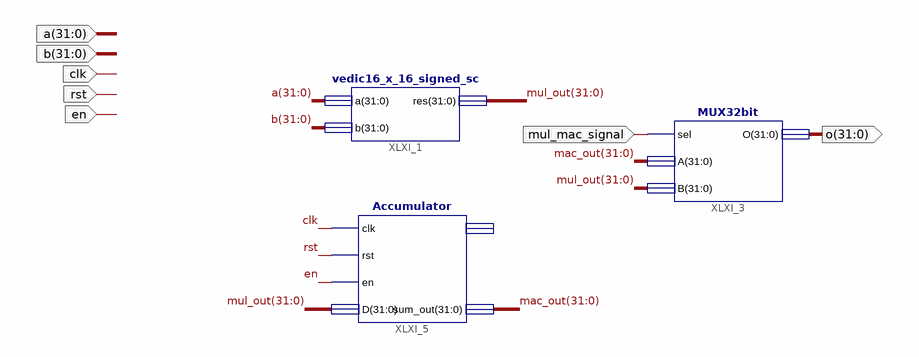
[diagram p0: schematic sheet 1]
// Xilinx ISE schematic MAC_Unit.sch (spartan6) as structural Verilog: 3 symbols, 7 ports
module MAC_Unit (
  input  [31:0] a,
  input  [31:0] b,
  input  clk,
  input  rst,
  input  en,
  input  mul_mac_signal,
  output [31:0] o
);

  wire [31:0] mac_out, mul_out;

  vedic16_x_16_signed_sc XLXI_1 (.a(a), .b(b), .res(mul_out));
  MUX32bit XLXI_3 (.sel(mul_mac_signal), .A(mac_out), .B(mul_out), .O(o));
  Accumulator XLXI_5 (.clk(clk), .rst(rst), .en(en), .D(mul_out), .sum_out(mac_out));  // open: Q
endmodule
